# Altium schematic sheet digital_host_for_ADS1216_power.SchDoc
size 420 x 297 mm; Address1: Address1; Address2: Address2; Address3: Address3; Address4: Address4; SheetNumber: 1; Scale: 1:1; Разраб.: Иванов; Обозначение документа: АБВГ.123456.001 Э3; Пров.: Петров; Утв.: Сидоров; Наименование организации: ОАО "Концерн "МПО-Гидроприбор"; Перв. применение: АБВГ.123456.000; Наименование изделия 1: Плата; Наименование изделия 2: Схема электрическая; Наименование изделия 3: принципиальная; Нач. отд.: Нач. отд.; Фамилия нач. отд.: Сидоров
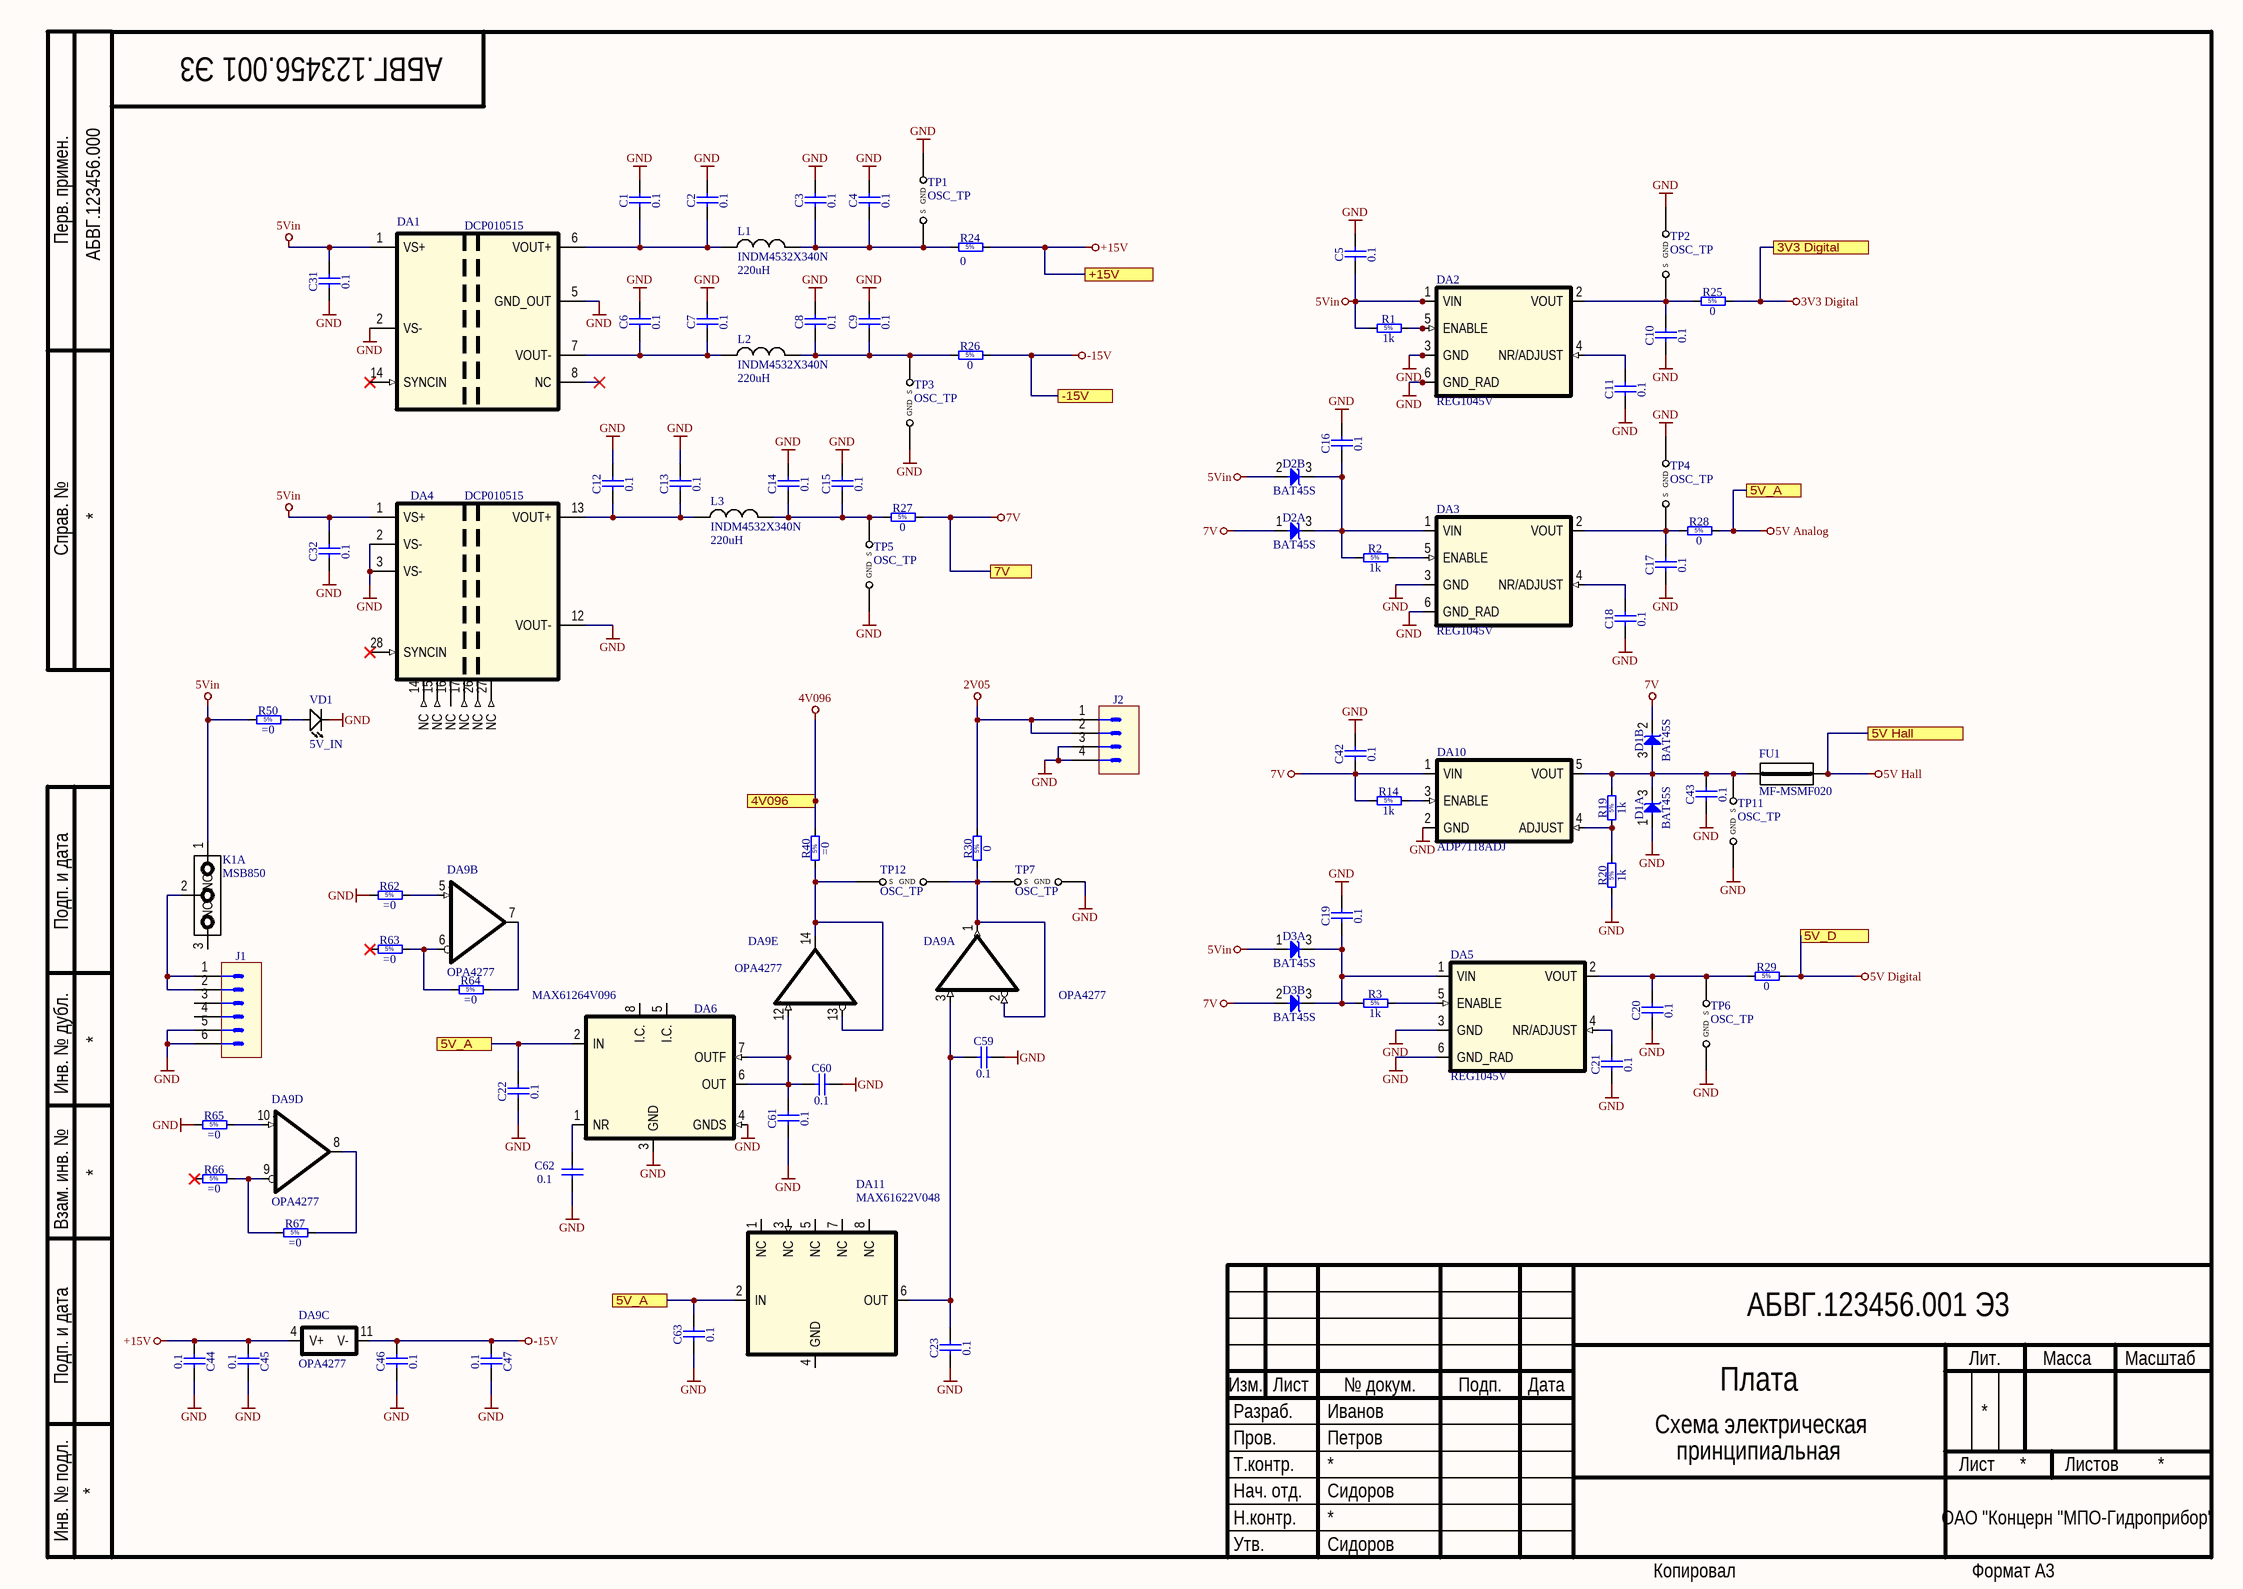
[diagram p0: digital_host_for_ADS1216_power.SchDoc]

## Parts
C1  0.1  [CAPC2012X90N]
C2  0.1  [CAPC2012X90N]
C3  0.1  [CAPC2012X90N]
C4  0.1  [CAPC2012X90N]
C5  0.1  [CAPC2012X90N]
C6  0.1  [CAPC2012X90N]
C7  0.1  [CAPC2012X90N]
C8  0.1  [CAPC2012X90N]
C9  0.1  [CAPC2012X90N]
C10  0.1  [CAPC2012X90N]
C11  0.1  [CAPC2012X90N]
C12  0.1  [CAPC2012X90N]
C13  0.1  [CAPC2012X90N]
C14  0.1  [CAPC2012X90N]
C15  0.1  [CAPC2012X90N]
C16  0.1  [CAPC2012X90N]
C17  0.1  [CAPC2012X90N]
C18  0.1  [CAPC2012X90N]
C19  0.1  [CAPC2012X90N]
C20  0.1  [CAPC2012X90N]
C21  0.1  [CAPC2012X90N]
C22  0.1  [CAPC2012X90N]
C23  0.1  [CAPC2012X90N]
C31  0.1  [CAPC2012X90N]
C32  0.1  [CAPC2012X90N]
C42  0.1  [CAPC2012X90N]
C43  0.1  [CAPC2012X90N]
C44  0.1  [CAPC2012X90N]
C45  0.1  [CAPC2012X90N]
C46  0.1  [CAPC2012X90N]
C47  0.1  [CAPC2012X90N]
C59  0.1  [CAPC2012X90N]
C60  0.1  [CAPC2012X90N]
C61  0.1  [CAPC2012X90N]
C62  0.1  [CAPC2012X90N]
C63  0.1  [CAPC2012X90N]
D1  BAT45S  [SOT-23]  (parts A,B of 2)
D2  BAT45S  [SOT-23]  (parts A,B of 2)
D3  BAT45S  [SOT-23]  (parts A,B of 2)
DA1  DCP010515  [NVA7]
DA2  REG1045V  [SOT223_6-127]
DA3  REG1045V  [SOT223_6-127]
DA4  DCP010515  [SOIC127P1033X265-12_28N]
DA5  REG1045V  [SOT223_6-127]
DA6  MAX61264V096  [SO8]
DA9  OPA4277  [SOIC14]  (parts A,B,C,D,E of 5)
DA10  ADP7118ADJ  [SOT95P270X145-5N]
DA11  MAX61622V048  [SO8]
FU1  MF-MSMF020  [MSMF020]
J1  (no value)  [MOLEX_22-27-2061]
J2  (no value)  [MOLEX_22-27-2041]
K1  MSB850  [MSB850]  (part A of 2)
L1  INDM4532X340N  Inductance: 220uH  [INDM4532X340N]
L2  INDM4532X340N  Inductance: 220uH  [INDM4532X340N]
L3  INDM4532X340N  Inductance: 220uH  [INDM4532X340N]
R1  1k  [RESC2012X70N]
R2  1k  [RESC2012X70N]
R3  1k  [RESC2012X70N]
R14  1k  [RESC2012X70N]
R19  1k  [RESC2012X70N]
R20  1k  [RESC2012X70N]
R24  0  [RESC2012X70N]
R25  0  [RESC2012X70N]
R26  0  [RESC2012X70N]
R27  0  [RESC2012X70N]
R28  0  [RESC2012X70N]
R29  0  [RESC2012X70N]
R30  0  [RESC2012X70N]
R40  (no value)  [RESC2012X70N]
R50  (no value)  [RESC2012X70N]
R62  (no value)  [RESC2012X70N]
R63  (no value)  [RESC2012X70N]
R64  (no value)  [RESC2012X70N]
R65  (no value)  [RESC2012X70N]
R66  (no value)  [RESC2012X70N]
R67  (no value)  [RESC2012X70N]
TP1  OSC_TP  [TP2]
TP2  OSC_TP  [TP2]
TP3  OSC_TP  [TP2]
TP4  OSC_TP  [TP2]
TP5  OSC_TP  [TP2]
TP6  OSC_TP  [TP2]
TP7  OSC_TP  [TP2]
TP11  OSC_TP  [TP2]
TP12  OSC_TP  [TP2]
VD1  5V_IN  [LED0603]

## Ports
3V3 Digital, 4V096, 5V Hall, 5V_A, 5V_D, 7V, +15V, -15V

## Nets
2V05: J2.1 J2.2 R30.2
3V3 Digital: R25.2 ; port 3V3 Digital
4V096: R40.2 ; port 4V096
5V Analog: C22.2 C63.2 DA6.2(IN) DA11.2(IN) R28.2 ; port 5V_A
5V Digital: R29.2 ; port 5V_D
5V Hall: FU1.2 ; port 5V Hall
5Vin: C5.1 C31.2 C32.2 D2.2(A) D3.1(A) DA1.1(VS+) DA2.1(VIN) DA4.1(VS+) K1.1(NO) R1.1 R50.2
7V: C42.1 D1.2(COMAC) D2.1(A) D3.2(A) DA10.1(VIN) R14.1 R27.2 ; port 7V
+15V: C44.1 C45.1 DA9.4(V+) R24.2 ; port +15V
-15V: C46.2 C47.1 DA9.11(V-) R26.2 ; port -15V
GND: C1.2 C2.2 C3.2 C4.2 C5.2 C6.2 C7.2 C8.2 C9.2 C10.1 C11.1 C12.2 C13.2 C14.2 C15.2 C16.2 C17.1 C18.1 C19.2 C20.1 C21.1 C22.1 C23.1 C31.1 C32.1 C42.2 C43.1 C44.2 C45.2 C46.1 C47.2 C59.2 C60.2 C61.1 C62.1 C63.1 D1.1(A) DA1.2(VS-) DA1.5(GND_OUT) DA2.3(GND) DA2.6(GND_RAD) DA3.3(GND) DA3.6(GND_RAD) DA4.2(VS-) DA4.3(VS-) DA4.12(VOUT-) DA5.3(GND) DA5.6(GND_RAD) DA6.3(GND) DA6.4(GNDS) DA10.2(GND) J1.5 J1.6 J2.3 J2.4 R20.1 R62.1 R65.1 TP1.2(GND) TP2.2(GND) TP3.2(GND) TP4.2(GND) TP5.2(GND) TP6.2(GND) TP7.2(GND) TP11.2(GND) VD1.1(Cathode)
NetC1_1: C1.1 C2.1 DA1.6(VOUT+) L1.1
NetC3_1: C3.1 C4.1 L1.2 R24.1 TP1.1(S)
NetC6_1: C6.1 C7.1 DA1.7(VOUT-) L2.1
NetC8_1: C8.1 C9.1 L2.2 R26.1 TP3.1(S)
NetC10_2: C10.2 DA2.2(VOUT) R25.1 TP2.1(S)
NetC11_2: C11.2 DA2.4(NR/ADJUST)
NetC12_1: C12.1 C13.1 DA4.13(VOUT+) L3.1
NetC14_1: C14.1 C15.1 L3.2 R27.1 TP5.1(S)
NetC16_1: C16.1 D2.3(COMAC) DA3.1(VIN) R2.1
NetC17_2: C17.2 DA3.2(VOUT) R28.1 TP4.1(S)
NetC18_2: C18.2 DA3.4(NR/ADJUST)
NetC19_1: C19.1 D3.3(COMAC) DA5.1(VIN) R3.1
NetC20_2: C20.2 DA5.2(VOUT) R29.1 TP6.1(S)
NetC21_2: C21.2 DA5.4(NR/ADJUST)
NetC23_2: C23.2 C59.1 DA9.3(+) DA11.6(OUT)
NetC43_2: C43.2 D1.3(COMAC) DA10.5(VOUT) FU1.1 R19.2 TP11.1(S)
NetC60_1: C60.1 C61.2 DA6.6(OUT) DA6.7(OUTF) DA9.12(+)
NetC62_2: C62.2 DA6.1(NR)
NetDA2_5: DA2.5(ENABLE) R1.2
NetDA3_5: DA3.5(ENABLE) R2.2
NetDA5_5: DA5.5(ENABLE) R3.2
NetDA9_1: DA9.1(OUT) DA9.2(-) R30.1 TP7.1(S) TP12.2(GND)
NetDA9_5: DA9.5(+) R62.2
NetDA9_6: DA9.6(-) R63.2 R64.1
NetDA9_7: DA9.7(OUT) R64.2
NetDA9_8: DA9.8(OUT) R67.2
NetDA9_9: DA9.9(-) R66.2 R67.1
NetDA9_10: DA9.10(+) R65.2
NetDA9_13: DA9.13(-) DA9.14(OUT) R40.1 TP12.1(S)
NetDA10_3: DA10.3(ENABLE) R14.2
NetDA10_4: DA10.4(ADJUST) R19.1 R20.2
NetJ1_1: J1.1 J1.2 K1.2(Cetnter)
NetR50_1: R50.1 VD1.2(Anode)

Not connected (* = marked no-connect by the designer): DA1 8(NC)* 14(SYNCIN)*; DA4 14(NC) 15(NC) 16(NC) 17(NC) 26(NC) 27(NC) 28(SYNCIN)*; DA6 5(I.C.) 8(I.C.); DA11 1(NC) 3(NC) 4(GND) 5(NC) 7(NC) 8(NC); J1 3 4; K1 3(NC); R63 1*; R66 1*

## Notes on the sheet
- Перв. примен.
- Справ. №
- Подп. и дата
- Инв. № дубл.
- Взам. инв. №
- Разраб.
- Изм.
- Лист
- № докум.
- Подп.
- Дата
- Лит.
- Масса
- Масштаб
- Пров.
- Т.контр.
- Листов
- Инв. № подл.
- Утв.
- Н.контр.
- Копировал
- Формат А3

## Library data of the parts
C1-C23 C31 C32 C42-C47 C59-C63 = Capacitor - non polarized: Non-polarised capacitor2012; SolderOption: 0; SMD Solders: 2; Dielectric type: X5R; Vendor: any; Value: 0.1; THD Solders: 0
D1 = BAT54S: Serial Shottky Diode; SMD Solders: 3; THD Sollders: 0; Vendor: NXP; Unut Price: 10; Device: BAT45S; Package: SOT23
D2 D3 = BAT54C: Common Cathode 2 Shottky Diode; SMD Solders: 3; THD Sollders: 0; Vendor: NXP; Unut Price: 10; Device: BAT45S; Package: SOT23
DA1 = DCP020515: DC/DC 5V to isolated +-15V; Vendor: Texas Instruments; Copyright: Copyright (C) 2022 Ultra Librarian. All rights reserved.; Value: DCP010515; Price: 1000
DA2 = REG104_5V: Positive LDO Linear stabilizer 5Vin to 3V3Digital; Vendor: Texas Instruments; Device: REG104; Value: 5V; SMD Solder: 6; THD Solder: 0; Unit Price: 6; Package: SOT223-6; SolderOption: 0
DA3 = REG104_5V: Positive LDO Linear stabilizer 7V to 5V Analog; Vendor: Texas Instruments; Device: REG104; SMD Solder: 6; THD Solder: 0; Unit Price: 6; Package: SOT223-6; Value: 5V; SolderOption: 0
DA4 = DCP020507U: DC/DC 5V to isolated +-7V; Vendor: Texas Instruments; Copyright: Copyright (C) 2022 Ultra Librarian. All rights reserved.; Value: DCP010515; Price: 1000
DA5 = REG104_5V: Positive LDO Linear stabilizer 7V to 5V Digital; Vendor: Texas Instruments; Device: REG104; SMD Solder: 6; THD Solder: 0; Unit Price: 6; Package: SOT223-6; Value: 5V; SolderOption: 0
DA6 = MAX6126: Positive LDO Linear stabilizer; Vendor: Maxim; Value: 4V096; SMD Solder: 8; THD Solder: 0; Device: MAX6126; Unit Price: 2000; Package: SOIC_8; SolderOption: 0
DA9 = OPA4277: счетверённый ОУ; Vendor: Texas Instruments; Voltage: 3..30V/+-1.5..+-15V; Bandwidth: 1.3MHz; SolderOption: Norm; Value: OPA4277
DA10 = ADP7118: Positive LDO Linear stabilizer; Vendor: Analog Devoces; Value: ADJ; SMD Solder: 5; THD Solder: 0; Device: ADP7118; Unit Price: 100; Package: SOT23-5; SolderOption: 0
DA11 = MAX6162: Reference LDO Linear stabilizer; Vendor: Maxim; Value: 2V048; SMD Solder: 8; THD Solder: 0; Device: MAX6162; Unit Price: 2000; Package: SOIC_8; SolderOption: 0
FU1 = MF-MSMF: Предохранитель самовосстанавливающийся; Vendor: Bourns; SolderOption: Norm; Price: 20; Value: MF-MSMF020
J1 = WF6: Connector 4 Male; THD Solders: 4; SMD Solders: 0; Vendor: Molex; Value: WF6; SolderOption: 0
J2 = WF4: Connector 4 Male; THD Solders: 4; SMD Solders: 0; Vendor: Molex; Value: WF4; SolderOption: 0
K1 = MSB850: Кнопка с фиксацией 2xSPDT; SolderOption: Norm; Price: 1; Vendor: *; Value: MSB850
L1-L3 = INDM4532X340N: SMD Дроссель; Vendor: Sumida; Curent: 0.5A; Price: 100; Value: INDM4532X340N
R1-R3 R14 R19 R20 = Resistor - 5%: Vendor: any; SMD Solders: 2; THD Solders: 0; TK: 1000ppmC^(-1); Value: 1k; SolderOption: 0; Tolerance: 5%
R24-R30 = Resistor - 5%: Vendor: any; SMD Solders: 2; SolderOption: NP; TK: 1000ppmC^(-1); THD Solders: 0; Value: 0; Tolerance: 5%
R40 R50 R62-R67 = Resistor - 5%: Vendor: any; SMD Solders: 2; THD Solders: 0; Value: 1k; TK: 1000ppmC^(-1); SolderOption: 0; Tolerance: 5%
TP1-TP7 TP11 TP12 = OscTP: Контрольная точка для подключения осциллографа короткой землёй; Vendor: PCB; Price: 0; Value: OSC_TP; SolderOption: PCB
VD1 = LED0603: Чип светодиод 0603; Vendor: KB; Color: Green; SolderOpton: Norm; Price: 20; Value: 5V_IN